# Altium schematic sheet EE_smallOB_BW_v1.0.SchDoc
size A
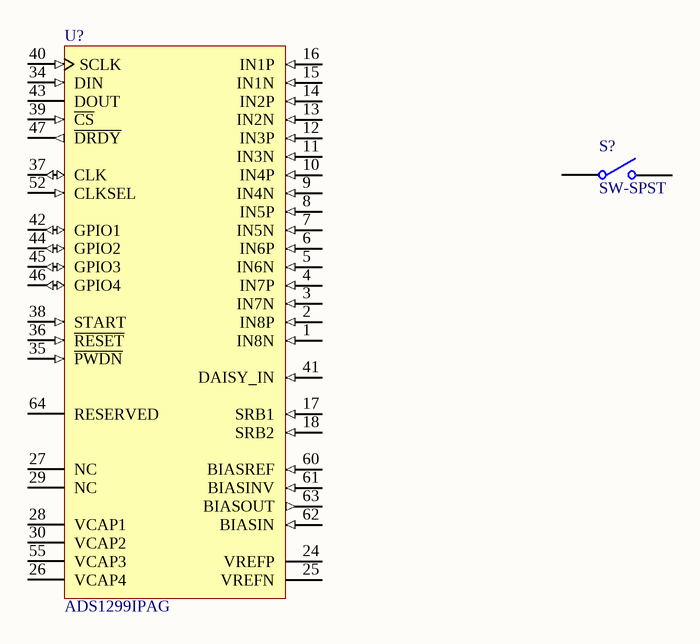
[diagram p0: EE_smallOB_BW_v1.0.SchDoc]

## Parts
S?  SW-SPST  [SPST-2]
U?  ADS1299IPAG  [PAG0064A_N]

## Nets

Not connected (* = marked no-connect by the designer): S? 1(COMMON) 2(NO); U? 1(IN8N) 2(IN8P) 3(IN7N) 4(IN7P) 5(IN6N) 6(IN6P) 7(IN5N) 8(IN5P) 9(IN4N) 10(IN4P) 11(IN3N) 12(IN3P) 13(IN2N) 14(IN2P) 15(IN1N) 16(IN1P) 17(SRB1) 18(SRB2) 24(VREFP) 25(VREFN) 26(VCAP4) 27(NC) 28(VCAP1) 29(NC) 30(VCAP2) 34(DIN) 35(~{PWDN}) 36(~{RESET}) 37(CLK) 38(START) 39(~{CS}) 40(SCLK) 41(DAISY_IN) 42(GPIO1) 43(DOUT) 44(GPIO2) 45(GPIO3) 46(GPIO4) 47(~{DRDY}) 52(CLKSEL) 55(VCAP3) 60(BIASREF) 61(BIASINV) 62(BIASIN) 63(BIASOUT) 64(RESERVED)

## Library data of the parts
S? = SW-SPST: Single-Pole, Single-Throw Switch; Published: 24-Mar-1999; LatestRevisionDate: 17-Jul-2002; LatestRevisionNote: Re-released for DXP Platform.; PackageReference: SPST-2; Publisher: Altium Limited; PackageDescription: Switch; 2 Leads
U? = ADS1299IPAG: IC AFE 24BIT 16KSPS LN 64TQFP; Manufacturer 1: Texas Instruments; Number of Channels: 8; Max Power Dissipation: 42mW; Max Supply Voltage: 5.25V; Interface: SPI; Resolution: 24b; Number of Bits: 24; Sampling Rate: 16KS/s; Operating Supply Current: 7.14mA; Signal to Noise Ratio (SNR): 121dB; Power Consumption: 41mW; Min Supply Voltage: 4.75V; Supplier 1: Digi-Key; Manufacturer Part Number 1: ADS1299IPAG; Stock 1: 447; Pricing 1: 1=55.18000, 10=51.83200, 25=50.16000, 100=46.48160 (USD); RoHS: Yes; Case/Package: TQFP; Number of Pins: 64; Contact Plating: Gold; Min Operating Temperature: -40°C; Max Operating Temperature: 85°C; Package Quantity: 160; Packaging: Rail/Tube; Number of Converters: 8; Conversion Rate: 16KS/s; Number of Inputs: 8; Number of A/D Converters: 8; Type: General Purpose; Radiation Hardening: No; Lead Free: Lead Free; REACH SVHC: No SVHC; ComponentLink1URL: https://datasheet.ciiva.com/13063/ads1299-224171-13063283.pdf?src-supplier=Mouser; ComponentLink1Description: https://datasheet.ciiva.com/13063/ads1299-224171-13063283.pdf?src-supplier=Mouser; ComponentLink2URL: https://datasheet.ciiva.com/26913/getdatasheetpartid-563195-26913237.pdf?src-supplier=Verical; ComponentLink2Description: https://datasheet.ciiva.com/26913/getdatasheetpartid-563195-26913237.pdf?src-supplier=Verical; ComponentLink3URL: https://datasheet.ciiva.com/6668/ads1299-6668469.pdf?src-supplier=Digi-Key; ComponentLink3Description: https://datasheet.ciiva.com/6668/ads1299-6668469.pdf?src-supplier=Digi-Key; Supplier Part Number 1: 296-35009-ND